# Altium project GEN3_FanCtrl_PROD_V03.PrjPcb (part 1 of 3)
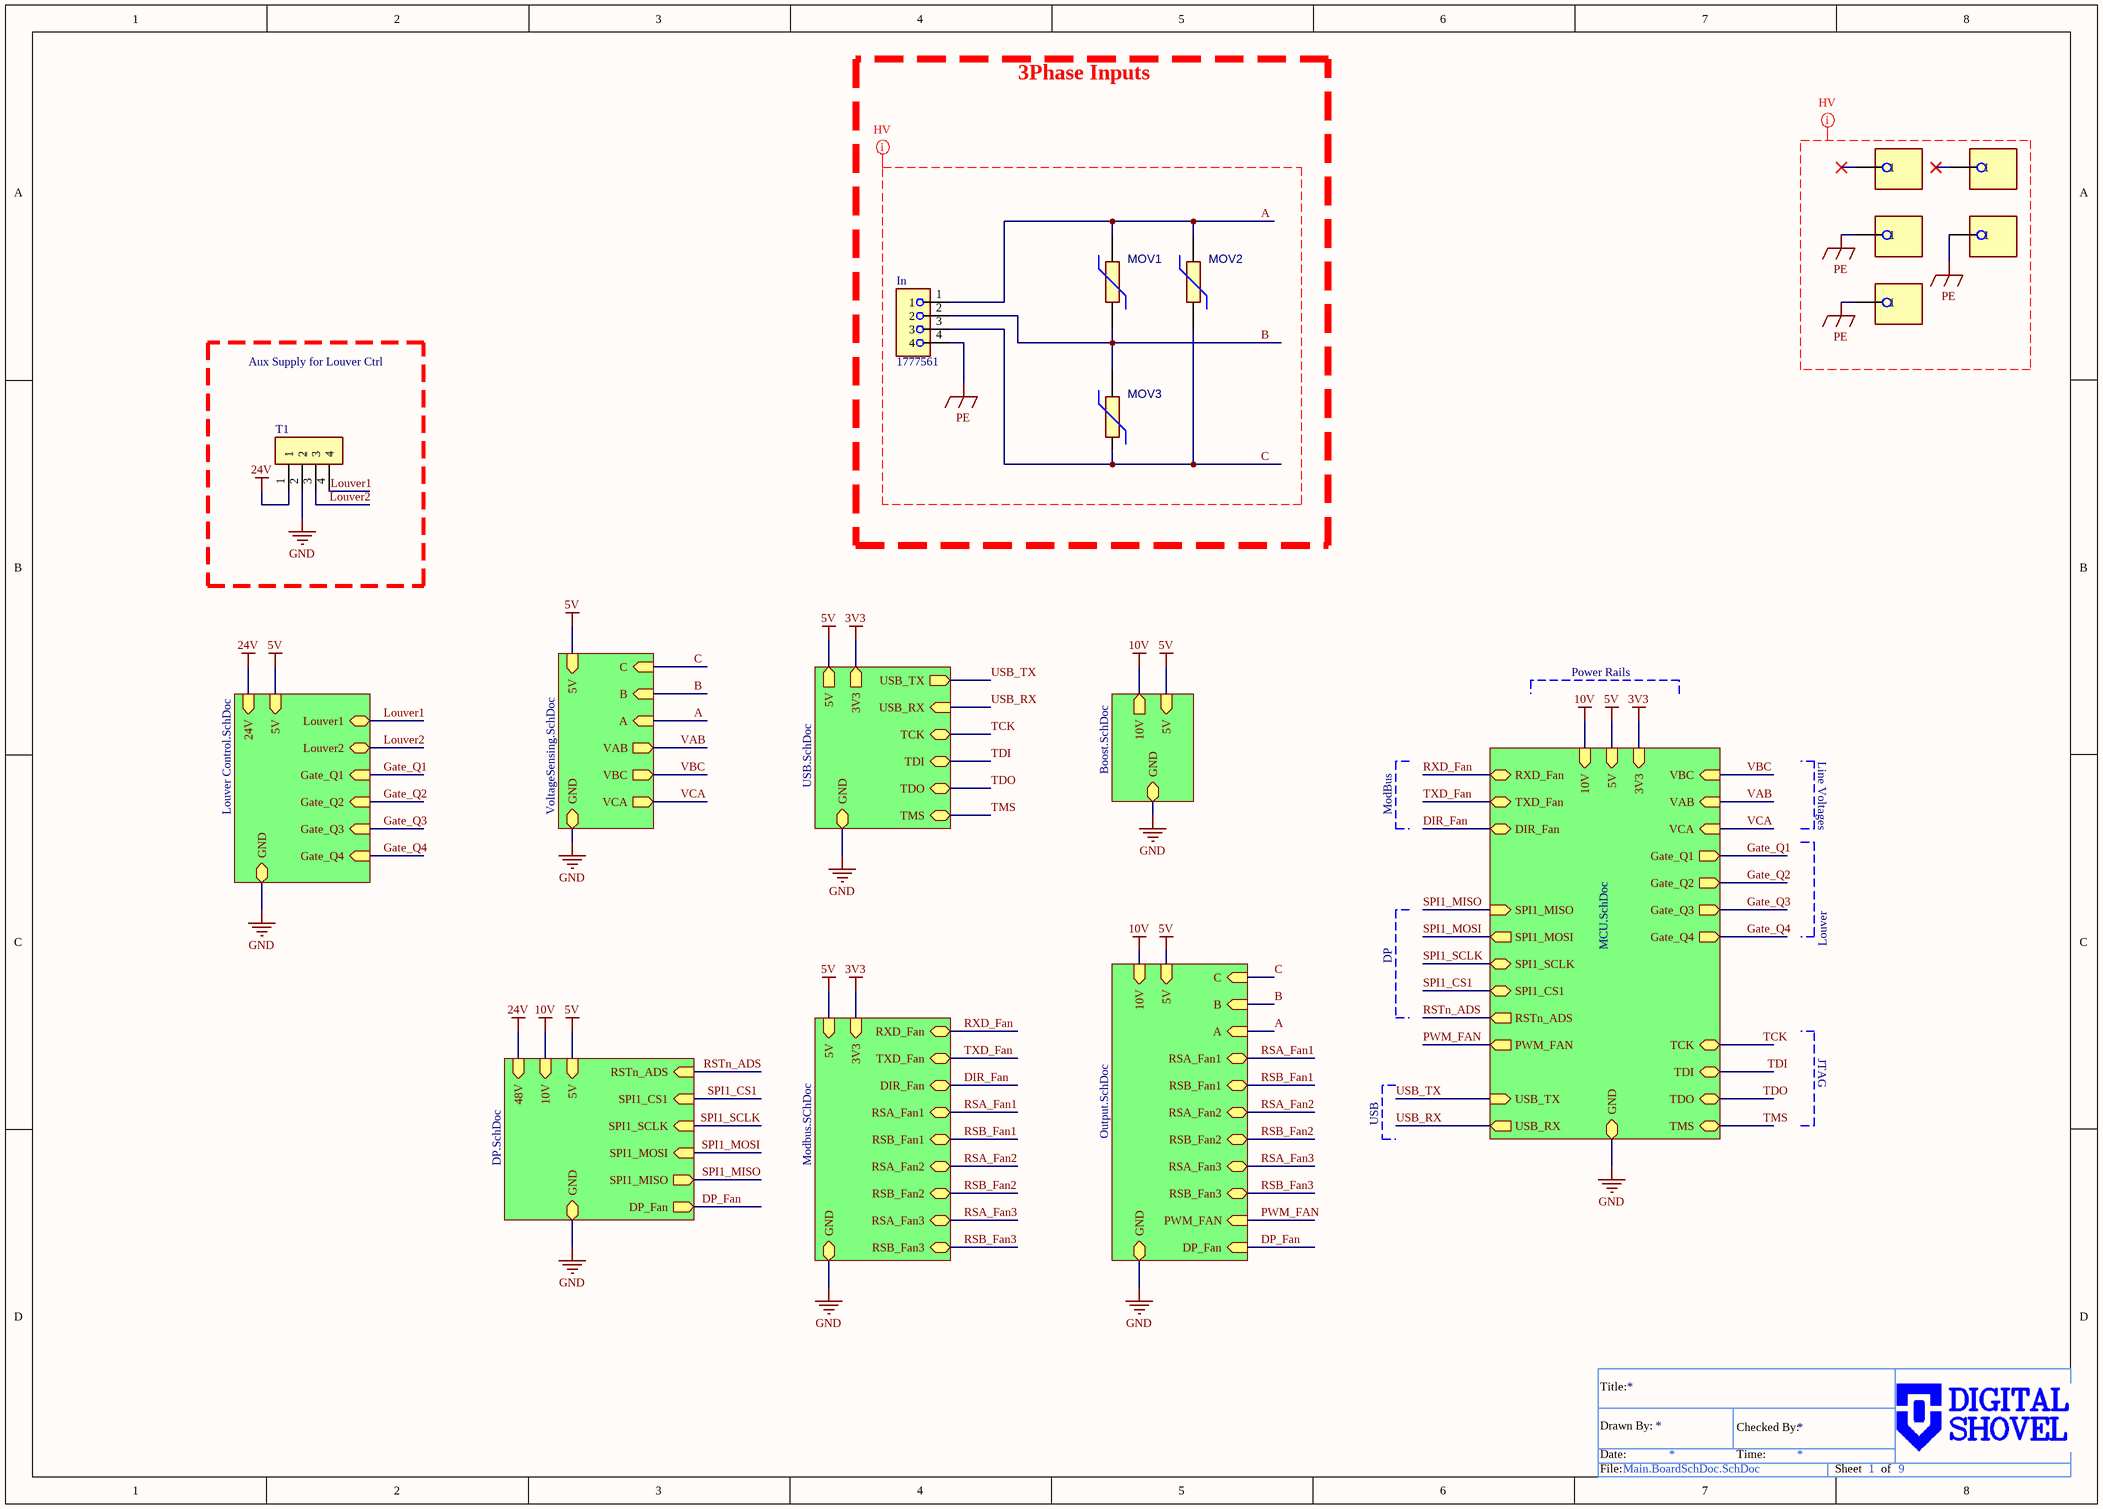
[diagram p0: Main.BoardSchDoc.SchDoc]
9 sheets, 371 parts. Net scope: hierarchical (ports join the sheet entries above them; power ports are global).
Board files: GEN3_FanCtrl_PROD_PCB_V03.PcbDoc, GEN3_FanCtrl_PROD_PCB_V03_Panel.PcbDoc
Sheets:
  Main.BoardSchDoc.SchDoc
    Designator = VoltageSensing.SchDoc
    Designator = Boost.SchDoc
    Designator = Output.SchDoc
    Designator = MCU.SchDoc
    Designator = USB.SchDoc
    Designator = ModBus.SchDoc
    Designator = DP.SchDoc
    Designator = Louver Control.SchDoc

## Sheet Main.BoardSchDoc.SchDoc
size A3; SheetNumber: 1; SheetTotal: 9; SPICEModelCachePYKVLZSU: <root> / <DocumentId>PYKVLZSU</DocumentId> / </root>

### Parts
1  Mounting Hole  [Mounting Hole]  (value not drawn)
3  Mounting Hole  [Mounting Hole]  (value not drawn)
4  Mounting Hole  [Mounting Hole]  (value not drawn)
5  Mounting Hole  [Mounting Hole]  (value not drawn)
6  Mounting Hole  [Mounting Hole]  (value not drawn)
In  1777561  [1777561-Footprint-1]
MOV1  MOV-14D102K  [MOV-14D102K-Footprint-1]  (value not drawn)
MOV2  MOV-14D102K  [MOV-14D102K-Footprint-1]  (value not drawn)
MOV3  MOV-14D102K  [MOV-14D102K-Footprint-1]  (value not drawn)
T1  1984633  [1984633-Footprint-1]  (value not drawn)

### Blocks framed on the sheet
3Phase Inputs: In MOV1-MOV3
Aux Supply for Louver Ctrl: T1

### Sub-sheets
Designator = VoltageSensing.SchDoc: GND (bidir), 5V (in), A (in), B (in), C (in), VAB (out), VBC (out), VCA (out)
Designator = Boost.SchDoc: GND (bidir), 5V (in), 10V (out)
Designator = Output.SchDoc: GND (bidir), 10V (in), A (in), B (in), C (in), 5V (in), RSA_Fan1 (bidir), RSB_Fan1 (bidir), RSA_Fan2 (bidir), RSB_Fan2 (bidir), RSA_Fan3 (bidir), RSB_Fan3 (bidir), PWM_FAN (in), DP_Fan (in)
Designator = MCU.SchDoc: VAB (in), VBC (in), VCA (in), GND (bidir), SPI1_MISO (in), SPI1_MOSI (out), SPI1_SCLK (bidir), SPI1_CS1 (bidir), 5V (in), PWM_FAN (out), RSTn_ADS (out), USB_TX (in), USB_RX (out), 3V3 (in), TCK (bidir), TDI (bidir), TDO (bidir), TMS (bidir), RXD_Fan (bidir), TXD_Fan (bidir), 10V (in), DIR_Fan (bidir), Gate_Q1 (out), Gate_Q2 (out), Gate_Q3 (out), Gate_Q4 (out)
Designator = USB.SchDoc: GND (bidir), TDI (bidir), USB_TX (out), USB_RX (in), TCK (bidir), 5V (out), TDO (bidir), 3V3 (out), TMS (bidir)
Designator = Modbus.SChDoc: GND (bidir), RXD_Fan (bidir), TXD_Fan (bidir), 5V (in), 3V3 (in), RSA_Fan1 (bidir), RSB_Fan1 (bidir), RSA_Fan2 (bidir), RSB_Fan2 (bidir), RSA_Fan3 (bidir), RSB_Fan3 (bidir), DIR_Fan (bidir)
Designator = DP.SchDoc: GND (bidir), SPI1_CS1 (in), SPI1_MISO (out), SPI1_MOSI (in), SPI1_SCLK (in), 5V (in), RSTn_ADS (in), DP_Fan (out), 10V (in), 48V (in)
Designator = Louver Control.SchDoc: GND (bidir), 24V (in), Louver1 (bidir), Louver2 (bidir), 5V (in), Gate_Q1 (in), Gate_Q2 (in), Gate_Q3 (in), Gate_Q4 (in)

### Nets
3V3: sheet Designator/3V3, sheet Designator/3V3, sheet Designator/3V3
5V: sheet Designator/5V, sheet Designator/5V, sheet Designator/5V, sheet Designator/5V, sheet Designator/5V, sheet Designator/5V, sheet Designator/5V, sheet Designator/5V
10V: sheet Designator/10V, sheet Designator/10V, sheet Designator/10V, sheet Designator/10V
24V: T1.1 ; sheet Designator/48V, sheet Designator/24V
GND: T1.2 ; sheet Designator/GND, sheet Designator/GND, sheet Designator/GND, sheet Designator/GND, sheet Designator/GND, sheet Designator/GND, sheet Designator/GND, sheet Designator/GND
PE: 1.1 5.1 6.1 In.4
A: In.1 MOV1.2 MOV2.2 ; sheet Designator/A, sheet Designator/A
B: In.2 MOV1.1 MOV3.2 ; sheet Designator/B, sheet Designator/B
C: In.3 MOV2.1 MOV3.1 ; sheet Designator/C, sheet Designator/C
DIR_Fan: sheet Designator/DIR_Fan, sheet Designator/DIR_Fan
DP_Fan: sheet Designator/DP_Fan, sheet Designator/DP_Fan
Gate_Q1: sheet Designator/Gate_Q1, sheet Designator/Gate_Q1
Gate_Q2: sheet Designator/Gate_Q2, sheet Designator/Gate_Q2
Gate_Q3: sheet Designator/Gate_Q3, sheet Designator/Gate_Q3
Gate_Q4: sheet Designator/Gate_Q4, sheet Designator/Gate_Q4
Louver1: T1.4 ; sheet Designator/Louver1
Louver2: T1.3 ; sheet Designator/Louver2
PWM_FAN: sheet Designator/PWM_FAN, sheet Designator/PWM_FAN
RSA_Fan1: sheet Designator/RSA_Fan1, sheet Designator/RSA_Fan2, sheet Designator/RSA_Fan3, sheet Designator/RSA_Fan1, sheet Designator/RSA_Fan2, sheet Designator/RSA_Fan3  [also labelled RSA_Fan2, RSA_Fan3]
RSB_Fan1: sheet Designator/RSB_Fan1, sheet Designator/RSB_Fan2, sheet Designator/RSB_Fan3, sheet Designator/RSB_Fan1, sheet Designator/RSB_Fan2, sheet Designator/RSB_Fan3  [also labelled RSB_Fan2, RSB_Fan3]
RSTn_ADS: sheet Designator/RSTn_ADS, sheet Designator/RSTn_ADS  [project net INT17a]
RXD_Fan: sheet Designator/RXD_Fan, sheet Designator/RXD_Fan
SPI1_CS1: sheet Designator/SPI1_CS1, sheet Designator/SPI1_CS1  [project net ~{C}S]
SPI1_MISO: sheet Designator/SPI1_MISO, sheet Designator/SPI1_MISO  [project net MISO]
SPI1_MOSI: sheet Designator/SPI1_MOSI, sheet Designator/SPI1_MOSI  [project net MOSI]
SPI1_SCLK: sheet Designator/SPI1_SCLK, sheet Designator/SPI1_SCLK  [project net SCLK]
TCK: sheet Designator/TCK, sheet Designator/TCK
TDI: sheet Designator/TDI, sheet Designator/TDI
TDO: sheet Designator/TDO, sheet Designator/TDO
TMS: sheet Designator/TMS, sheet Designator/TMS
TXD_Fan: sheet Designator/TXD_Fan, sheet Designator/TXD_Fan
USB_RX: sheet Designator/USB_RX, sheet Designator/USB_RX
USB_TX: sheet Designator/USB_TX, sheet Designator/USB_TX
VAB: sheet Designator/VAB, sheet Designator/VAB  [project net AINA07]
VBC: sheet Designator/VBC, sheet Designator/VBC  [project net AINA06]
VCA: sheet Designator/VCA, sheet Designator/VCA  [project net AINA05]

Not connected (* = marked no-connect by the designer): 3 1*; 4 1*

### Layout directives
net class HV: A, B, C, PE

### Notes on the sheet
- Power Rails
- Line Voltages
- ModBus
- Louver
- DP
- JTAG
- USB
- Title:
- Date:
- Drawn By:
- Time:
- Checked By:
- File:
- Sheet
- of

### Library data of the parts
1 3-6 = CMP-002-00649-4: Aluminum 1/4 Hex Female Standoff, 4MM
In = CMP-002-01216-2: 4 Position Wire to Board Terminal Block Horizontal with Board 0.250" (6.35mm) Through Hole; Voltage Rating: 1kV; Max Current Rating: 30A; Mounting Technology: Board; RoHS Compliant: Yes
MOV1-MOV3 = CMP-009-01038-1: Varistor, 825V, 190J, Through Hole Mount; Power: 600mW; Pins: 2; Max Operating Temperature: 85°C; RoHS Compliant: Yes; Min Operating Temperature: -40°C; Mounting Technology: Through Hole
T1 = CMP-002-01217-1: Barrier Strip Terminal Block, 17.5A, 1.5mm2, 1 Row(s), 1 Deck(s); Voltage Rating: 200V; RoHS Compliant: Yes; Mounting Technology: Board

## Sheet VoltageSensing.SchDoc
size A4; SPICEModelCacheCLRMJWCR: <root> / <DocumentId>CLRMJWCR</DocumentId> / <CacheFrame Number="0"> / <Model Name="tmk107b7105_a-t" Kind="CKT"> / <Text>* TMK107B7105_A-T     SPICE MODEL  ( General Type ) / *-------------------------------------------------------------------------------------------------------- / * Model Generated by TAIYO YUDEN Corporation (http://www.ty-top.com) / * Version 1.0 / * TAIYO YUDEN Control No. 170508_100817 / * Copyright(c) 2012 TAIYO YUDEN CO.,LTD. All Rights Reserved. / *-------------------------------------------------------------------------------------------------------- / * / * Products Name : Multilayer Ceramic Capacitors / * / * Characteristics : / *     Capacitance : 1 uF , Rated Voltage : 25V , TCC : X7R / *     Case Size : 1.6 x 0.8 / 0.063 x 0.031 [mm/inch] , Thickness : 0.8 / 0.031 [mm/inch] / *     (Conditions: Temperature = 25 degC , DC Bias Current/Voltage = 0A / 0V) / * / * Frequency Range : 40Hz - 3GHz / * / * External Node Assignments : / * / *  1  o---| |---o  2 / * / *-------------------------------------------------------------------------------------------------------- / .SubCkt TMK107B7105_A-T 1 2 / **************************** / C0 1 110 0.8077u / Cm 1 101 0.091409u / C1 101 102 0.22841u / Rc1 101 102 2.6849k / C2 102 103 0.056864u / Rc2 102 103 354.66 / C3 103 110 0.05273u / Rc3 103 110 25.631 / C2m 1 301 0.15309u / C21 301 302 0.37938u / Rc21 301 302 9.5172k / C22 302 303 0.45808u / Rc22 302 303 6.9429k / C23 303 304 0.40786u / Rc23 303 304 2.3301k / C24 304 305 0.15311u / Rc24 304 305 806.02 / C25 305 306 0.22413u / Rc25 305 306 462.56 / C26 306 307 0.18632u / Rc26 306 307 35.279 / C27 307 308 0.15722u / Rc27 307 308 39.531 / C28 308 309 0.078196u / Rc28 308 309 48.947 / C29 309 110 6560.8p / Rc29 309 110 9.5708 / Rp0 1 110 100Meg / L0 110 120 0.29644n / Lm 120 130 0.15558n / L1 120 121 0.202n / RL1 121 130 0.16398 / L2 120 122 0.33479n / RL2 122 130 0.31977 / L3 120 123 0.92343n / RL3 123 130 0.85069 / CR 120 124 0.21801u / LR 124 125 0.13885n / RR 125 130 35.905m / CL 130 140 1.934p / LL 130 140 0.19618n / RL 130 140 45.012 / Rs 140 2 6.428m / **************************** / .ends TMK107B7105_A-T</Text> / </Model> / </CacheFrame> / </root>; SheetNumber: 5; SheetTotal: 9
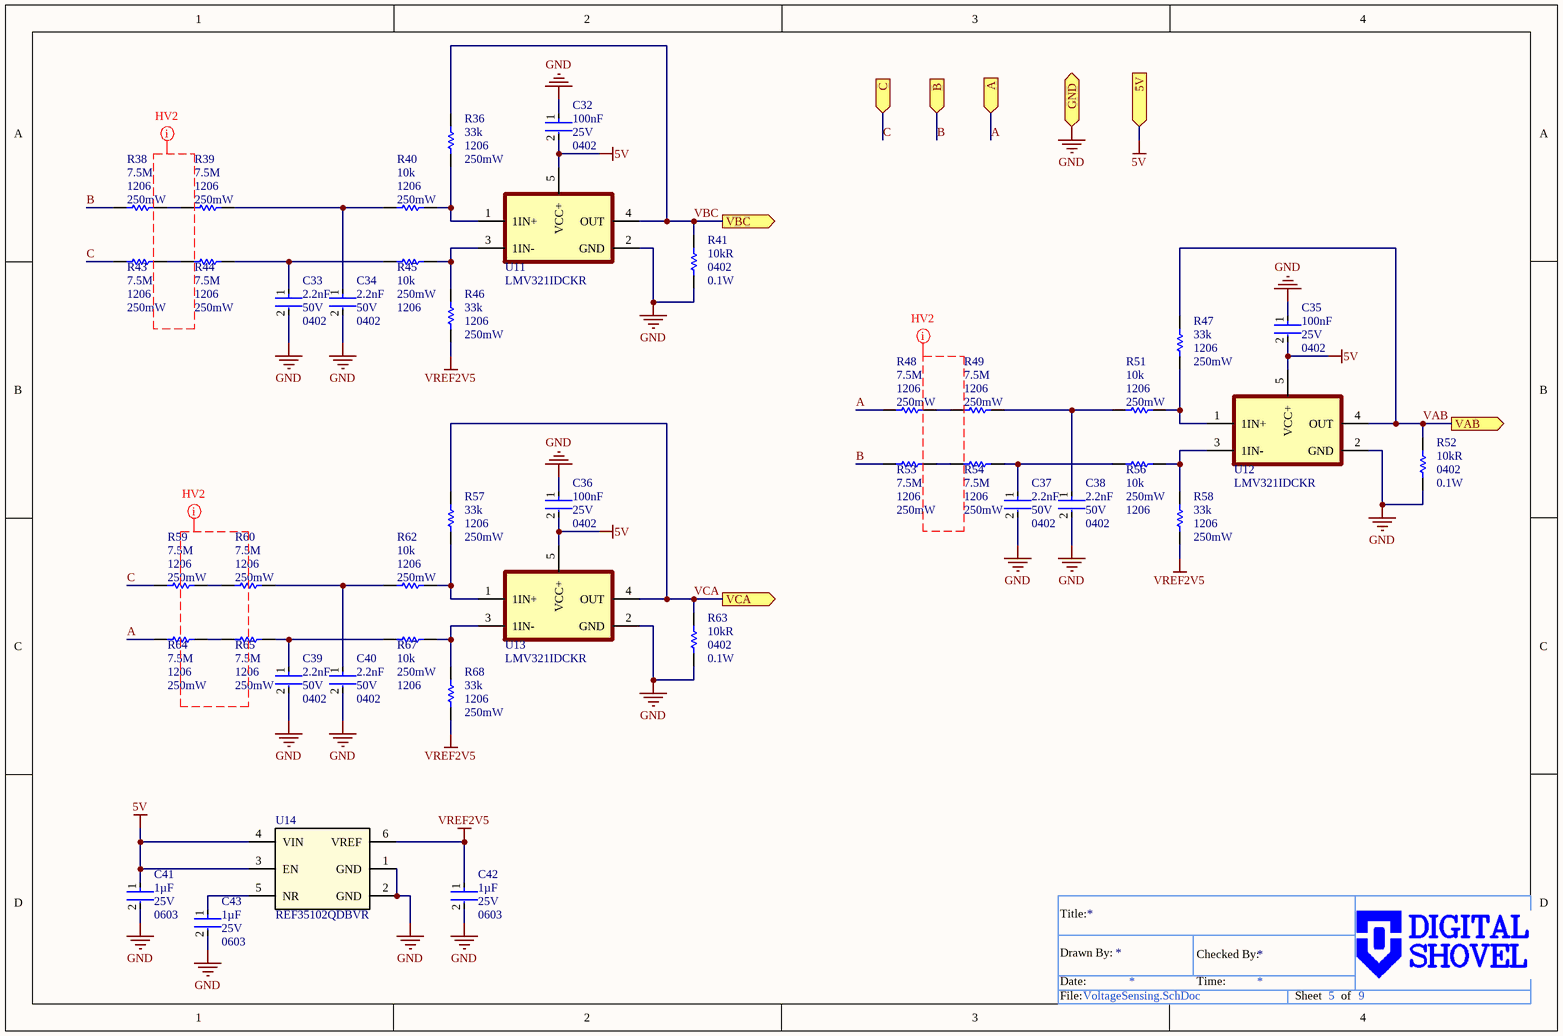
[diagram p1: VoltageSensing.SchDoc]

### Parts
C32  value 100nF  Voltage Rating: 25V  Case/Package: 0402  [FP-CL830-IPC_A]  (hidden comment: CL05B104KA5NNNC)
C33  value 2.2nF  Voltage Rating: 50V  Case/Package: 0402  [FP-C0402-BB-IPC_A]  (hidden comment: C0402C222J5RACTU)
C34  value 2.2nF  Voltage Rating: 50V  Case/Package: 0402  [FP-C0402-BB-IPC_A]  (hidden comment: C0402C222J5RACTU)
C35  value 100nF  Voltage Rating: 25V  Case/Package: 0402  [FP-CL830-IPC_A]  (hidden comment: CL05B104KA5NNNC)
C36  value 100nF  Voltage Rating: 25V  Case/Package: 0402  [FP-CL830-IPC_A]  (hidden comment: CL05B104KA5NNNC)
C37  value 2.2nF  Voltage Rating: 50V  Case/Package: 0402  [FP-C0402-BB-IPC_A]  (hidden comment: C0402C222J5RACTU)
C38  value 2.2nF  Voltage Rating: 50V  Case/Package: 0402  [FP-C0402-BB-IPC_A]  (hidden comment: C0402C222J5RACTU)
C39  value 2.2nF  Voltage Rating: 50V  Case/Package: 0402  [FP-C0402-BB-IPC_A]  (hidden comment: C0402C222J5RACTU)
C40  value 2.2nF  Voltage Rating: 50V  Case/Package: 0402  [FP-C0402-BB-IPC_A]  (hidden comment: C0402C222J5RACTU)
C41  value 1µF  Voltage Rating: 25V  Case/Package: 0603  [FP-0603-L_1_6_0_1-W_0_8_0-IPC_A]  (hidden comment: TMK107B7105KA-T)
C42  value 1µF  Voltage Rating: 25V  Case/Package: 0603  [FP-0603-L_1_6_0_1-W_0_8_0-IPC_A]  (hidden comment: TMK107B7105KA-T)
C43  value 1µF  Voltage Rating: 25V  Case/Package: 0603  [FP-0603-L_1_6_0_1-W_0_8_0-IPC_A]  (hidden comment: TMK107B7105KA-T)
R36  value 33k  Power: 250mW  Case/Package: 1206  [RESC3216X70X40NL20T20]  (hidden comment: RK73H2BTTD3302F)
R38  value 7.5M  Case/Package: 1206  Power: 250mW  [FP-KTR18-IPC_A]  (hidden comment: KTR18EZPF7504)
R39  value 7.5M  Case/Package: 1206  Power: 250mW  [FP-KTR18-IPC_A]  (hidden comment: KTR18EZPF7504)
R40  value 10k  Power: 250mW  Case/Package: 1206  [RESC3216X70X40NL20T20]  (hidden comment: RK73H2BTTD1002F)
R41  value 10kR  Package: 0402  Power: 0.1W  [RESC1005X40X25LL10T10]  (hidden comment: RK73H1ETTP1002F)
R43  value 7.5M  Case/Package: 1206  Power: 250mW  [FP-KTR18-IPC_A]  (hidden comment: KTR18EZPF7504)
R44  value 7.5M  Case/Package: 1206  Power: 250mW  [FP-KTR18-IPC_A]  (hidden comment: KTR18EZPF7504)
R45  value 10k  Power: 250mW  Case/Package: 1206  [RESC3216X70X40NL20T20]  (hidden comment: RK73H2BTTD1002F)
R46  value 33k  Power: 250mW  Case/Package: 1206  [RESC3216X70X40NL20T20]  (hidden comment: RK73H2BTTD3302F)
R47  value 33k  Power: 250mW  Case/Package: 1206  [RESC3216X70X40NL20T20]  (hidden comment: RK73H2BTTD3302F)
R48  value 7.5M  Case/Package: 1206  Power: 250mW  [FP-KTR18-IPC_A]  (hidden comment: KTR18EZPF7504)
R49  value 7.5M  Case/Package: 1206  Power: 250mW  [FP-KTR18-IPC_A]  (hidden comment: KTR18EZPF7504)
R51  value 10k  Power: 250mW  Case/Package: 1206  [RESC3216X70X40NL20T20]  (hidden comment: RK73H2BTTD1002F)
R52  value 10kR  Package: 0402  Power: 0.1W  [RESC1005X40X25LL10T10]  (hidden comment: RK73H1ETTP1002F)
R53  value 7.5M  Case/Package: 1206  Power: 250mW  [FP-KTR18-IPC_A]  (hidden comment: KTR18EZPF7504)
R54  value 7.5M  Case/Package: 1206  Power: 250mW  [FP-KTR18-IPC_A]  (hidden comment: KTR18EZPF7504)
R56  value 10k  Power: 250mW  Case/Package: 1206  [RESC3216X70X40NL20T20]  (hidden comment: RK73H2BTTD1002F)
R57  value 33k  Power: 250mW  Case/Package: 1206  [RESC3216X70X40NL20T20]  (hidden comment: RK73H2BTTD3302F)
R58  value 33k  Power: 250mW  Case/Package: 1206  [RESC3216X70X40NL20T20]  (hidden comment: RK73H2BTTD3302F)
R59  value 7.5M  Case/Package: 1206  Power: 250mW  [FP-KTR18-IPC_A]  (hidden comment: KTR18EZPF7504)
R60  value 7.5M  Case/Package: 1206  Power: 250mW  [FP-KTR18-IPC_A]  (hidden comment: KTR18EZPF7504)
R62  value 10k  Power: 250mW  Case/Package: 1206  [RESC3216X70X40NL20T20]  (hidden comment: RK73H2BTTD1002F)
R63  value 10kR  Package: 0402  Power: 0.1W  [RESC1005X40X25LL10T10]  (hidden comment: RK73H1ETTP1002F)
R64  value 7.5M  Case/Package: 1206  Power: 250mW  [FP-KTR18-IPC_A]  (hidden comment: KTR18EZPF7504)
R65  value 7.5M  Case/Package: 1206  Power: 250mW  [FP-KTR18-IPC_A]  (hidden comment: KTR18EZPF7504)
R67  value 10k  Power: 250mW  Case/Package: 1206  [RESC3216X70X40NL20T20]  (hidden comment: RK73H2BTTD1002F)
R68  value 33k  Power: 250mW  Case/Package: 1206  [RESC3216X70X40NL20T20]  (hidden comment: RK73H2BTTD3302F)
U11  LMV321IDCKR  [LMV321IDCKR-Footprint-1]
U12  LMV321IDCKR  [LMV321IDCKR-Footprint-1]
U13  LMV321IDCKR  [LMV321IDCKR-Footprint-1]
U14  REF35102QDBVR  [REF35102QDBVR-Footprint-1]

### Ports
5V (in), A (in), B (in), C (in), GND (bidir), VAB (out), VBC (out), VCA (out)

### Nets
5V: C32.2 C35.2 C36.2 C41.1 U11.5(VCC+) U12.5(VCC+) U13.5(VCC+) U14.3(EN) U14.4(VIN) ; port 5V
GND: C32.1 C33.2 C34.2 C35.1 C36.1 C37.2 C38.2 C39.2 C40.2 C41.2 C42.2 C43.2 R41.2 R52.2 R63.2 U11.2(GND) U12.2(GND) U13.2(GND) U14.1(GND) U14.2(GND) ; port GND
VREF2V5: C42.1 R46.1 R58.1 R68.1 U14.6(VREF)
A: R48.2 R64.2 ; port A
B: R38.2 R53.2 ; port B
C: R43.2 R59.2 ; port C
VAB: R47.2 R52.1 U12.4(OUT) ; port VAB  [project net AINA07]
VBC: R36.2 R41.1 U11.4(OUT) ; port VBC  [project net AINA06]
VCA: R57.2 R63.1 U13.4(OUT) ; port VCA  [project net AINA05]
NetC33_1: C33.1 R44.1 R45.1
NetC34_1: C34.1 R39.1 R40.1
NetC37_1: C37.1 R54.1 R56.1
NetC38_1: C38.1 R49.1 R51.1
NetC39_1: C39.1 R65.1 R67.1
NetC40_1: C40.1 R60.1 R62.1
NetC43_1: C43.1 U14.5(NR)
NetR36_1: R36.1 R40.2 U11.1(1IN+)
NetR38_1: R38.1 R39.2
NetR43_1: R43.1 R44.2
NetR45_2: R45.2 R46.2 U11.3(1IN-)
NetR47_1: R47.1 R51.2 U12.1(1IN+)
NetR48_1: R48.1 R49.2
NetR53_1: R53.1 R54.2
NetR56_2: R56.2 R58.2 U12.3(1IN-)
NetR57_1: R57.1 R62.2 U13.1(1IN+)
NetR59_1: R59.1 R60.2
NetR64_1: R64.1 R65.2
NetR67_2: R67.2 R68.2 U13.3(1IN-)

### Layout directives
net class HV2: (no net found under the mark)

### Notes on the sheet
- Title:
- Date:
- Drawn By:
- Time:
- Checked By:
- File:
- Sheet
- of

### Library data of the parts
C32 C35 C36 = CMP-001-00333-1: Ceramic Capacitor, Multilayer, Ceramic, 25V, 10% +Tol, 10% -Tol, X7R, 15% TC, 0.1uF, Surface Mount, 0402; Max Operating Temperature: 125°C; RoHS Compliant: Yes; Capacitor Type: Ceramic; Min Operating Temperature: -55°C; Pins: 2; Mounting Technology: Surface Mount
C33 C34 C37-C40 = CMP-001-00335-1: Ceramic Capacitor, Multilayer, Ceramic, 50V, 5% +Tol, 5% -Tol, X7R, 15% TC, 0.0022uF, Surface Mount, 0402; Pins: 2; RoHS Compliant: Yes; Mounting Technology: Surface Mount; Max Operating Temperature: 125°C; Capacitor Type: Ceramic; Min Operating Temperature: -55°C
C41-C43 = CMP-001-00326-1: Ceramic Capacitor, Multilayer, Ceramic, 25V, 10% +Tol, 10% -Tol, X7R, 15% TC, 1uF, Surface Mount, 0603; Pins: 2; Capacitor Type: Ceramic; Min Operating Temperature: -55°C; Max Operating Temperature: 125°C; RoHS Compliant: Yes; Mounting Technology: Surface Mount
R36 R46 R47 R57 R58 R68 = CMP-009-01018-1: Fixed Resistor, Metal Glaze/thick Film, 0.25W, 33000ohm, 200V, 1% +/-Tol, 100ppm/Cel, Surface Mount, 1206; Pins: 2; Max Operating Temperature: 155°C; Tolerance: 1%; Min Operating Temperature: -55°C; Mounting Technology: Surface Mount; RoHS Compliant: Yes
R38 R39 R43 R44 R48 R49 R53 R54 R59 R60 R64 R65 = CMP-009-01037-1: Fixed Resistor, 0.25W, 7500000ohm, 500V, 1% +/-Tol, 100ppm/Cel, Surface Mount, 1206; Voltage Rating: 500V; Min Operating Temperature: -55°C; Max Operating Temperature: 155°C; RoHS Compliant: Yes; Pins: 2; Mounting Technology: Surface Mount; Tolerance: 1%
R40 R45 R51 R56 R62 R67 = CMP-009-00976-1: Fixed Resistor, Metal Glaze/thick Film, 0.25W, 10000ohm, 200V, 1% +/-Tol, 100ppm/Cel, Surface Mount, 1206; RoHS Compliant: Yes; Pins: 2; Mounting Technology: Surface Mount; Tolerance: 1%; Max Operating Temperature: 155°C; Min Operating Temperature: -55°C
R41 R52 R63 = CMP-x00150-2: Fixed Resistor, Metal Glaze/thick Film, 0.1W, 10000ohm, 75V, 1% +/-Tol, 100ppm/Cel, Surface Mount, 0402; Template: KS_0402_R
U11-U13 = CMP-014-00033-1: Operational Amplifier, 1 Func, 7000uV Offset-Max, BIPolar, PDSO5; Channels: 1; Nominal Supply Voltage: 2.7V; Pins: 5; RoHS Compliant: Yes; Min Operating Temperature: -40°C; Case/Package: TSSOP; Max Operating Temperature: 125°C
U14 = CMP-031-00033-1: 650-nA quiescent current, 12-ppm/°C drift, ultra-low-power precision voltage reference 6-SOT-23 -40 to 125

## Sheet Boost.SchDoc
size A4; SheetNumber: 7; SheetTotal: 8
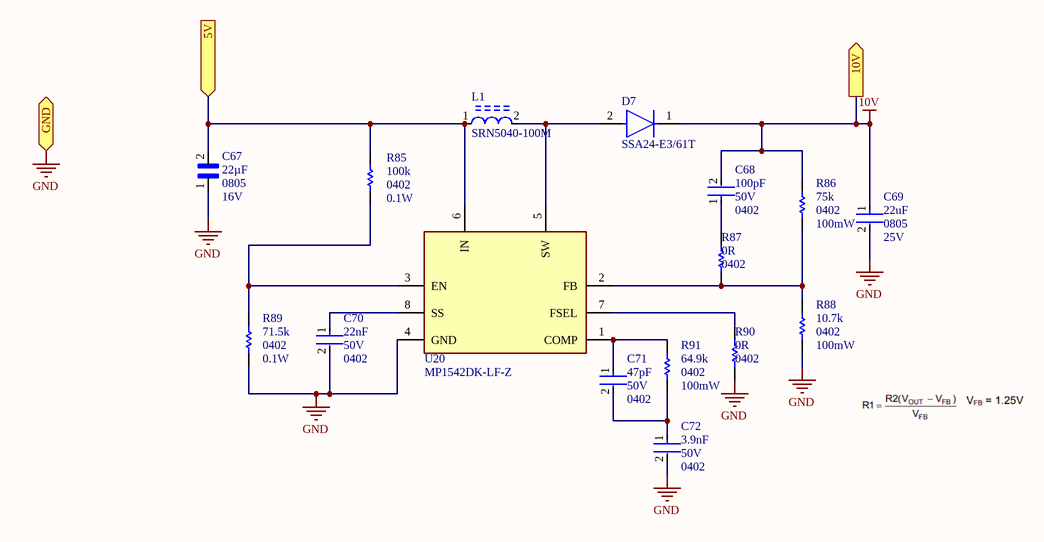
[diagram p2: Boost.SchDoc]

### Parts
C67  value 22µF  Case/Package: 0805  Voltage Rating: 16V  [CAPC0805(2012)145_L]  (hidden comment: CL21A226MOQNNNE)
C68  value 100pF  Package: 0402  Rating: 50V  [FP-CC0402-MFG]  (hidden comment: CC0402KRX7R9BB101)
C69  value 22uF  Package: 0805  Voltage Rating: 25V  [FP-GRM21B-0_2-e0_2_0_7-MFG]  (hidden comment: GRM21BR61E226ME44L)
C70  value 22nF  Case/Package: 0402  Voltage Rating: 50V  [FP-GCM155-0_05-IPC_A]  (hidden comment: GCM155R71H223KA55D)
C71  value 47pF  Package: 0402  Rating: 50V  [FP-C0402-BB-MFG]  (hidden comment: C0402C470J5GACTU)
C72  value 3.9nF  Case/Package: 0402  Voltage Rating: 50V  [FP-CC0402-IPC_A]  (hidden comment: CC0402KRX7R9BB392)
D7  SSA24-E3/61T  [FP-95400-MFG]
L1  SRN5040-100M  [FP-SRN5040-MFG]
R85  value 100k  Package: 0402  MOQ: 0.1W  [RESC1005X40X25LL10T10]  (hidden comment: RK73H1ETTP1003F)
R86  value 75k  Case/Package: 0402  Power: 100mW  [RESC1005X40X25LL10T10]  (hidden comment: RK73H1ETTP7502F)
R87  value 0R  Package: 0402  [FP-RK73Z1E-IPC_B]  (hidden comment: RK73Z1ETTP)
R88  value 10.7k  Power: 100mW  Case/Package: 0402  [RESC1005X40X25LL10T10]  (hidden comment: RK73H1ETTP1072F)
R89  value 71.5k  Mounting: 0402  Package: 0.1W  [RESC1005X40X25LL10T10]  (hidden comment: RK73H1ETTP7152F)
R90  value 0R  Package: 0402  [FP-RK73Z1E-IPC_B]  (hidden comment: RK73Z1ETTP)
R91  value 64.9k  Case/Package: 0402  Power: 100mW  [RESC1005X40X25LL10T10]  (hidden comment: RK73H1ETTP6492F)
U20  MP1542DK-LF-Z  [MP1542-Footprint-1]

### Ports
5V (in), 10V (out), GND (bidir)

### Nets
5V: C67.2 L1.1 R85.2 U20.6(IN) ; port 5V
10V: C68.2 C69.1 D7.1(C) R86.2 ; port 10V
GND: C67.1 C69.2 C70.2 C72.2 R88.1 R89.1 R90.1 U20.4(GND) ; port GND
NetC68_1: C68.1 R87.2
NetC70_1: C70.1 U20.8(SS)
NetC71_1: C71.1 R91.2 U20.1(COMP)
NetC71_2: C71.2 C72.1 R91.1
NetD7_2: D7.2(A) L1.2 U20.5(SW)
NetR85_1: R85.1 R89.2 U20.3(EN)
NetR86_1: R86.1 R87.1 R88.2 U20.2(FB)
NetR90_2: R90.2 U20.7(FSEL)

### Notes on the sheet
- Title:
- Date:
- Drawn By:
- Time:
- Checked By:
- File:
- Sheet
- of

### Library data of the parts
C67 = CMP-001-00081-17: Chip Capacitor, 22µF +/-40%, 16V, 0805, Thickness 1.45 mm; Tolerance: 5%; Max Operating Temperature: 85°C; Pins: 2; Mounting Technology: SMT; Min Operating Temperature: -55°C
C68 = CMP-x00153-2: Ceramic Capacitor, Multilayer, Ceramic, 50V, 10% +Tol, 10% -Tol, X7R, 15% TC, 0.0001uF, Surface Mount, 0402; Template: YG_0402_C
C69 = CMP-x00061-2: Ceramic Capacitor, Multilayer, Ceramic, 25V, 20% +Tol, 20% -Tol, X5R, 15% TC, 22uF, Surface Mount, 0805; Manufacturer: Murata; Vendor: TTI; Reel Width: 8mm; Template: MR_0805; Price: 0.093; MOQ: 3000; Category: Capacitor; Mounting: SMT
C70 = CMP-001-00345-1: Ceramic Capacitor, Multilayer, Ceramic, 50V, 10% +Tol, 10% -Tol, X7R, 15% TC, 0.022uF, Surface Mount, 0402; RoHS Compliant: Yes; Min Operating Temperature: -55°C; Pins: 2; Mounting Technology: Surface Mount; Max Operating Temperature: 125°C; Capacitor Type: Ceramic
C71 = CMP-x00009-2: Ceramic Capacitor, Multilayer, Ceramic, 50V, 5% +Tol, 5% -Tol, C0G, 30ppm/Cel TC, 0.000047uF, Surface Mount, 0402; Price: 0.0022; Mounting: SMT; MOQ: 10000
C72 = CMP-001-00344-1: Ceramic Capacitor, Multilayer, Ceramic, 50V, 10% +Tol, 10% -Tol, X7R, 15% TC, 0.0039uF, Surface Mount, 0402; Mounting Technology: Surface Mount; Capacitor Type: Ceramic; RoHS Compliant: Yes; Pins: 2; Min Operating Temperature: -55°C; Max Operating Temperature: 125°C
D7 = CMP-x00060-3: Rectifier Diode, Schottky, 1 Phase, 1 Element, 2A, 40V V(RRM), Silicon, DO-214AC; Manufacturer: Vishay; Template: VS_DO214; Vendor: TTI; Reel Width: 12mm; Value: 40V; Package: DO214AC; Price: 0.04; MOQ: 1800; Mounting: SMT; Category: Diode
L1 = CMP-x00063-2: General Purpose Inductor, 10uH, 20%, 1 Element, Ferrite-Core, SMD, 2020; Manufacturer: Bourns; Vendor: TTI; Reel Width: 12mm; Template: BR_5040; MOQ: 1000; Price: 0.18; Value: 10uH; Mounting: SMT; Category: Inductor; Package: 5040
R85 = CMP-x00162-2: Fixed Resistor, Metal Glaze/thick Film, 0.1W, 100000ohm, 75V, 1% +/-Tol, 100ppm/Cel, Surface Mount, 0402; Manufacturer: KOA Speer; Template: KS_0402_R; Mounting: SMD; Category: Resistors
R86 = CMP-009-01025-1: Fixed Resistor, Metal Glaze/thick Film, 0.1W, 75000ohm, 75V, 1% +/-Tol, 100ppm/Cel, Surface Mount, 0402; Max Operating Temperature: 155°C; RoHS Compliant: Yes; Tolerance: 1%; Pins: 2; Min Operating Temperature: -55°C; Mounting Technology: Surface Mount
R87 R90 = CMP-x00147-2: Metal Glaze/thick Film, 0ohm, Surface Mount, 0402; Template: KS_0402_R
R88 = CMP-009-01026-1: Fixed Resistor, Metal Glaze/thick Film, 0.1W, 10700ohm, 75V, 1% +/-Tol, 100ppm/Cel, Surface Mount, 0402; Max Operating Temperature: 155°C; RoHS Compliant: Yes; Pins: 2; Mounting Technology: Surface Mount; Tolerance: 1%; Min Operating Temperature: -55°C
R89 = CMP-x00176-1: Fixed Resistor, Metal Glaze/thick Film, 0.1W, 71500ohm, 75V, 1% +/-Tol, 100ppm/Cel, Surface Mount, 0402
R91 = CMP-009-01027-1: Fixed Resistor, Metal Glaze/thick Film, 0.1W, 64900ohm, 75V, 1% +/-Tol, 100ppm/Cel, Surface Mount, 0402; Mounting Technology: Surface Mount; Max Operating Temperature: 155°C; Pins: 2; Tolerance: 1%; Min Operating Temperature: -55°C; RoHS Compliant: Yes
U20 = CMP-x00054-4: Switching Regulator, Current-mode, 2A, 1500kHz Switching Freq-Max, PDSO8; Manufacturer: MPS; Value: 3V - 22V; Vendor: Mouser; Template: MP_MSOP_8; Reel Width: 12mm; Package: MSOP-8; Price: 1.25; MOQ: 2500; Mounting: SMT; Category: IC

## Sheet Output.SchDoc
size A2; SPICEModelCacheAEWMZWDM: <root> / <DocumentId>AEWMZWDM</DocumentId> / </root>; SheetNumber: 8; SheetTotal: 9
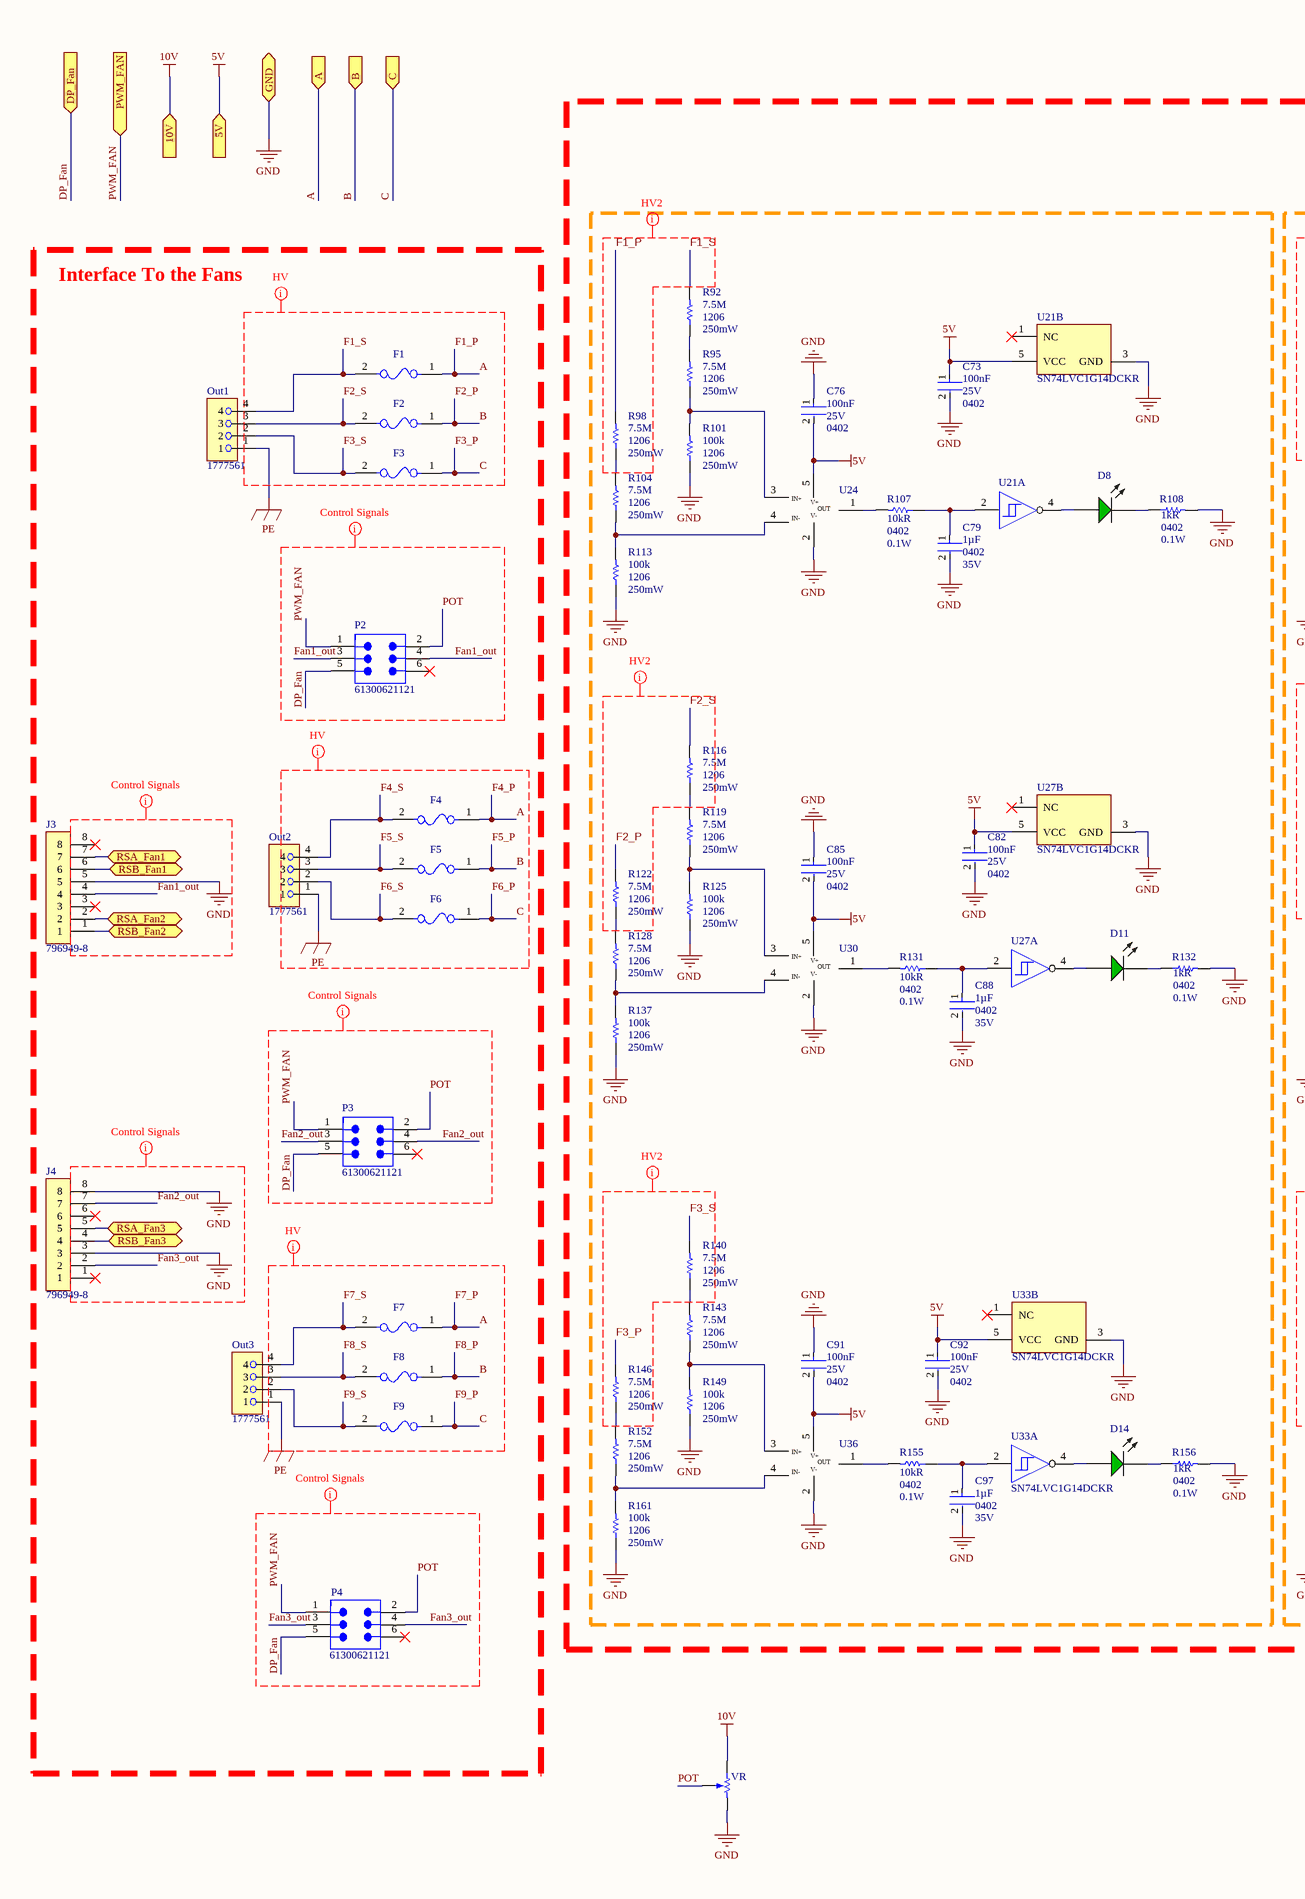
[diagram p3: Output.SchDoc, left]
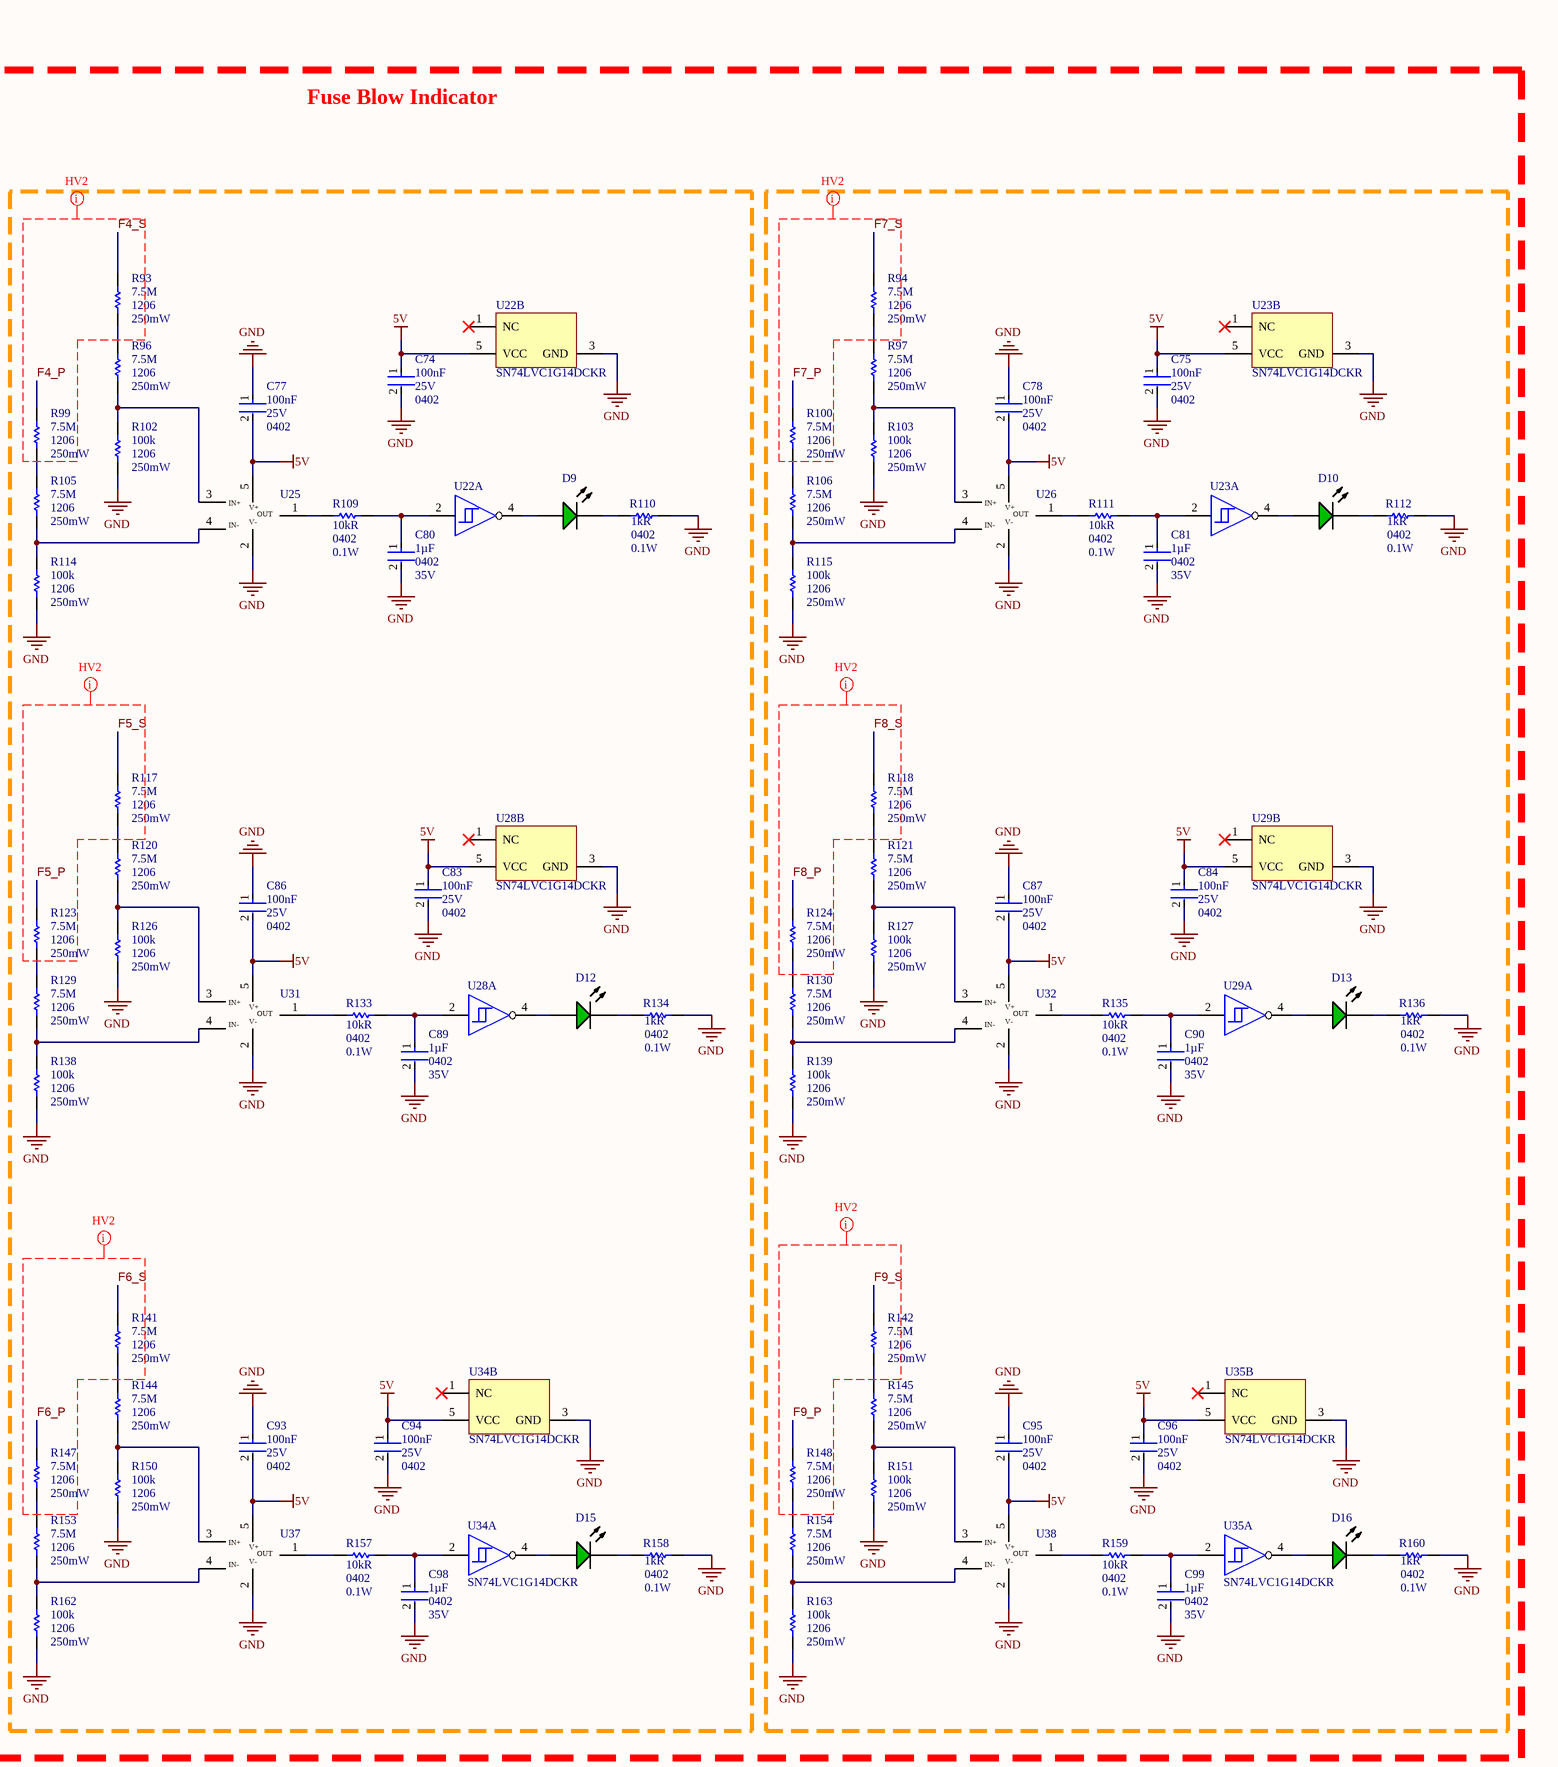
[diagram p4: Output.SchDoc, right]

### Parts
C73  value 100nF  Voltage Rating: 25V  Case/Package: 0402  [FP-CL830-IPC_A]  (hidden comment: CL05B104KA5NNNC)
C74  value 100nF  Voltage Rating: 25V  Case/Package: 0402  [FP-CL830-IPC_A]  (hidden comment: CL05B104KA5NNNC)
C75  value 100nF  Voltage Rating: 25V  Case/Package: 0402  [FP-CL830-IPC_A]  (hidden comment: CL05B104KA5NNNC)
C76  value 100nF  Voltage Rating: 25V  Case/Package: 0402  [FP-CL830-IPC_A]  (hidden comment: CL05B104KA5NNNC)
C77  value 100nF  Voltage Rating: 25V  Case/Package: 0402  [FP-CL830-IPC_A]  (hidden comment: CL05B104KA5NNNC)
C78  value 100nF  Voltage Rating: 25V  Case/Package: 0402  [FP-CL830-IPC_A]  (hidden comment: CL05B104KA5NNNC)
C79  value 1µF  Case/Package: 0402  Voltage Rating: 35V  [FP-C1005-050-0_05-IPC_A]  (hidden comment: C1005JB1V105K050BC)
C80  value 1µF  Case/Package: 0402  Voltage Rating: 35V  [FP-C1005-050-0_05-IPC_A]  (hidden comment: C1005JB1V105K050BC)
C81  value 1µF  Case/Package: 0402  Voltage Rating: 35V  [FP-C1005-050-0_05-IPC_A]  (hidden comment: C1005JB1V105K050BC)
C82  value 100nF  Voltage Rating: 25V  Case/Package: 0402  [FP-CL830-IPC_A]  (hidden comment: CL05B104KA5NNNC)
C83  value 100nF  Voltage Rating: 25V  Case/Package: 0402  [FP-CL830-IPC_A]  (hidden comment: CL05B104KA5NNNC)
C84  value 100nF  Voltage Rating: 25V  Case/Package: 0402  [FP-CL830-IPC_A]  (hidden comment: CL05B104KA5NNNC)
C85  value 100nF  Voltage Rating: 25V  Case/Package: 0402  [FP-CL830-IPC_A]  (hidden comment: CL05B104KA5NNNC)
C86  value 100nF  Voltage Rating: 25V  Case/Package: 0402  [FP-CL830-IPC_A]  (hidden comment: CL05B104KA5NNNC)
C87  value 100nF  Voltage Rating: 25V  Case/Package: 0402  [FP-CL830-IPC_A]  (hidden comment: CL05B104KA5NNNC)
C88  value 1µF  Case/Package: 0402  Voltage Rating: 35V  [FP-C1005-050-0_05-IPC_A]  (hidden comment: C1005JB1V105K050BC)
C89  value 1µF  Case/Package: 0402  Voltage Rating: 35V  [FP-C1005-050-0_05-IPC_A]  (hidden comment: C1005JB1V105K050BC)
C90  value 1µF  Case/Package: 0402  Voltage Rating: 35V  [FP-C1005-050-0_05-IPC_A]  (hidden comment: C1005JB1V105K050BC)
C91  value 100nF  Voltage Rating: 25V  Case/Package: 0402  [FP-CL830-IPC_A]  (hidden comment: CL05B104KA5NNNC)
C92  value 100nF  Voltage Rating: 25V  Case/Package: 0402  [FP-CL830-IPC_A]  (hidden comment: CL05B104KA5NNNC)
C93  value 100nF  Voltage Rating: 25V  Case/Package: 0402  [FP-CL830-IPC_A]  (hidden comment: CL05B104KA5NNNC)
C94  value 100nF  Voltage Rating: 25V  Case/Package: 0402  [FP-CL830-IPC_A]  (hidden comment: CL05B104KA5NNNC)
C95  value 100nF  Voltage Rating: 25V  Case/Package: 0402  [FP-CL830-IPC_A]  (hidden comment: CL05B104KA5NNNC)
C96  value 100nF  Voltage Rating: 25V  Case/Package: 0402  [FP-CL830-IPC_A]  (hidden comment: CL05B104KA5NNNC)
C97  value 1µF  Case/Package: 0402  Voltage Rating: 35V  [FP-C1005-050-0_05-IPC_A]  (hidden comment: C1005JB1V105K050BC)
C98  value 1µF  Case/Package: 0402  Voltage Rating: 35V  [FP-C1005-050-0_05-IPC_A]  (hidden comment: C1005JB1V105K050BC)
C99  value 1µF  Case/Package: 0402  Voltage Rating: 35V  [FP-C1005-050-0_05-IPC_A]  (hidden comment: C1005JB1V105K050BC)
D8  599-0480-127F  [QTLP650D4TR-Footprint-1]  (value not drawn)
D9  599-0480-127F  [QTLP650D4TR-Footprint-1]  (value not drawn)
D10  599-0480-127F  [QTLP650D4TR-Footprint-1]  (value not drawn)
D11  599-0480-127F  [QTLP650D4TR-Footprint-1]  (value not drawn)
D12  599-0480-127F  [QTLP650D4TR-Footprint-1]  (value not drawn)
D13  599-0480-127F  [QTLP650D4TR-Footprint-1]  (value not drawn)
D14  599-0480-127F  [QTLP650D4TR-Footprint-1]  (value not drawn)
D15  599-0480-127F  [QTLP650D4TR-Footprint-1]  (value not drawn)
D16  599-0480-127F  [QTLP650D4TR-Footprint-1]  (value not drawn)
F1  01220088ZR  [New footprint 1]  (value not drawn)
F2  01220088ZR  [New footprint 1]  (value not drawn)
F3  01220088ZR  [New footprint 1]  (value not drawn)
F4  01220088ZR  [New footprint 1]  (value not drawn)
F5  01220088ZR  [New footprint 1]  (value not drawn)
F6  01220088ZR  [New footprint 1]  (value not drawn)
F7  01220088ZR  [New footprint 1]  (value not drawn)
F8  01220088ZR  [New footprint 1]  (value not drawn)
F9  01220088ZR  [New footprint 1]  (value not drawn)
J3  796949-8  [796949-8-Footprint-1]
J4  796949-8  [796949-8-Footprint-1]
Out1  1777561  [1777561-Footprint-1]
Out2  1777561  [1777561-Footprint-1]
Out3  1777561  [1777561-Footprint-1]
P2  61300621121  [61300621121]
P3  61300621121  [61300621121]
P4  61300621121  [61300621121]
R92  value 7.5M  Case/Package: 1206  Power: 250mW  [FP-KTR18-IPC_A]  (hidden comment: KTR18EZPF7504)
R93  value 7.5M  Case/Package: 1206  Power: 250mW  [FP-KTR18-IPC_A]  (hidden comment: KTR18EZPF7504)
R94  value 7.5M  Case/Package: 1206  Power: 250mW  [FP-KTR18-IPC_A]  (hidden comment: KTR18EZPF7504)
R95  value 7.5M  Case/Package: 1206  Power: 250mW  [FP-KTR18-IPC_A]  (hidden comment: KTR18EZPF7504)
R96  value 7.5M  Case/Package: 1206  Power: 250mW  [FP-KTR18-IPC_A]  (hidden comment: KTR18EZPF7504)
R97  value 7.5M  Case/Package: 1206  Power: 250mW  [FP-KTR18-IPC_A]  (hidden comment: KTR18EZPF7504)
R98  value 7.5M  Case/Package: 1206  Power: 250mW  [FP-KTR18-IPC_A]  (hidden comment: KTR18EZPF7504)
R99  value 7.5M  Case/Package: 1206  Power: 250mW  [FP-KTR18-IPC_A]  (hidden comment: KTR18EZPF7504)
R100  value 7.5M  Case/Package: 1206  Power: 250mW  [FP-KTR18-IPC_A]  (hidden comment: KTR18EZPF7504)
R101  value 100k  Case/Package: 1206  Power: 250mW  [RESC3216X70X40NL20T20]  (hidden comment: RK73H2BTTD1003F)
R102  value 100k  Case/Package: 1206  Power: 250mW  [RESC3216X70X40NL20T20]  (hidden comment: RK73H2BTTD1003F)
R103  value 100k  Case/Package: 1206  Power: 250mW  [RESC3216X70X40NL20T20]  (hidden comment: RK73H2BTTD1003F)
R104  value 7.5M  Case/Package: 1206  Power: 250mW  [FP-KTR18-IPC_A]  (hidden comment: KTR18EZPF7504)
R105  value 7.5M  Case/Package: 1206  Power: 250mW  [FP-KTR18-IPC_A]  (hidden comment: KTR18EZPF7504)
R106  value 7.5M  Case/Package: 1206  Power: 250mW  [FP-KTR18-IPC_A]  (hidden comment: KTR18EZPF7504)
R107  value 10kR  Package: 0402  Power: 0.1W  [RESC1005X40X25LL10T10]  (hidden comment: RK73H1ETTP1002F)
R108  value 1kR  Package: 0402  Power: 0.1W  [RESC1005X40X25LL10T10]  (hidden comment: RK73H1ETTP1001F)
R109  value 10kR  Package: 0402  Power: 0.1W  [RESC1005X40X25LL10T10]  (hidden comment: RK73H1ETTP1002F)
R110  value 1kR  Package: 0402  Power: 0.1W  [RESC1005X40X25LL10T10]  (hidden comment: RK73H1ETTP1001F)
R111  value 10kR  Package: 0402  Power: 0.1W  [RESC1005X40X25LL10T10]  (hidden comment: RK73H1ETTP1002F)
R112  value 1kR  Package: 0402  Power: 0.1W  [RESC1005X40X25LL10T10]  (hidden comment: RK73H1ETTP1001F)
R113  value 100k  Case/Package: 1206  Power: 250mW  [RESC3216X70X40NL20T20]  (hidden comment: RK73H2BTTD1003F)
R114  value 100k  Case/Package: 1206  Power: 250mW  [RESC3216X70X40NL20T20]  (hidden comment: RK73H2BTTD1003F)
R115  value 100k  Case/Package: 1206  Power: 250mW  [RESC3216X70X40NL20T20]  (hidden comment: RK73H2BTTD1003F)
R116  value 7.5M  Case/Package: 1206  Power: 250mW  [FP-KTR18-IPC_A]  (hidden comment: KTR18EZPF7504)
R117  value 7.5M  Case/Package: 1206  Power: 250mW  [FP-KTR18-IPC_A]  (hidden comment: KTR18EZPF7504)
R118  value 7.5M  Case/Package: 1206  Power: 250mW  [FP-KTR18-IPC_A]  (hidden comment: KTR18EZPF7504)
R119  value 7.5M  Case/Package: 1206  Power: 250mW  [FP-KTR18-IPC_A]  (hidden comment: KTR18EZPF7504)
R120  value 7.5M  Case/Package: 1206  Power: 250mW  [FP-KTR18-IPC_A]  (hidden comment: KTR18EZPF7504)
R121  value 7.5M  Case/Package: 1206  Power: 250mW  [FP-KTR18-IPC_A]  (hidden comment: KTR18EZPF7504)
R122  value 7.5M  Case/Package: 1206  Power: 250mW  [FP-KTR18-IPC_A]  (hidden comment: KTR18EZPF7504)
R123  value 7.5M  Case/Package: 1206  Power: 250mW  [FP-KTR18-IPC_A]  (hidden comment: KTR18EZPF7504)
R124  value 7.5M  Case/Package: 1206  Power: 250mW  [FP-KTR18-IPC_A]  (hidden comment: KTR18EZPF7504)
R125  value 100k  Case/Package: 1206  Power: 250mW  [RESC3216X70X40NL20T20]  (hidden comment: RK73H2BTTD1003F)
R126  value 100k  Case/Package: 1206  Power: 250mW  [RESC3216X70X40NL20T20]  (hidden comment: RK73H2BTTD1003F)
R127  value 100k  Case/Package: 1206  Power: 250mW  [RESC3216X70X40NL20T20]  (hidden comment: RK73H2BTTD1003F)
R128  value 7.5M  Case/Package: 1206  Power: 250mW  [FP-KTR18-IPC_A]  (hidden comment: KTR18EZPF7504)
R129  value 7.5M  Case/Package: 1206  Power: 250mW  [FP-KTR18-IPC_A]  (hidden comment: KTR18EZPF7504)
R130  value 7.5M  Case/Package: 1206  Power: 250mW  [FP-KTR18-IPC_A]  (hidden comment: KTR18EZPF7504)
R131  value 10kR  Package: 0402  Power: 0.1W  [RESC1005X40X25LL10T10]  (hidden comment: RK73H1ETTP1002F)
R132  value 1kR  Package: 0402  Power: 0.1W  [RESC1005X40X25LL10T10]  (hidden comment: RK73H1ETTP1001F)
R133  value 10kR  Package: 0402  Power: 0.1W  [RESC1005X40X25LL10T10]  (hidden comment: RK73H1ETTP1002F)
R134  value 1kR  Package: 0402  Power: 0.1W  [RESC1005X40X25LL10T10]  (hidden comment: RK73H1ETTP1001F)
R135  value 10kR  Package: 0402  Power: 0.1W  [RESC1005X40X25LL10T10]  (hidden comment: RK73H1ETTP1002F)
R136  value 1kR  Package: 0402  Power: 0.1W  [RESC1005X40X25LL10T10]  (hidden comment: RK73H1ETTP1001F)
R137  value 100k  Case/Package: 1206  Power: 250mW  [RESC3216X70X40NL20T20]  (hidden comment: RK73H2BTTD1003F)
R138  value 100k  Case/Package: 1206  Power: 250mW  [RESC3216X70X40NL20T20]  (hidden comment: RK73H2BTTD1003F)
R139  value 100k  Case/Package: 1206  Power: 250mW  [RESC3216X70X40NL20T20]  (hidden comment: RK73H2BTTD1003F)
R140  value 7.5M  Case/Package: 1206  Power: 250mW  [FP-KTR18-IPC_A]  (hidden comment: KTR18EZPF7504)
R141  value 7.5M  Case/Package: 1206  Power: 250mW  [FP-KTR18-IPC_A]  (hidden comment: KTR18EZPF7504)
R142  value 7.5M  Case/Package: 1206  Power: 250mW  [FP-KTR18-IPC_A]  (hidden comment: KTR18EZPF7504)
R143  value 7.5M  Case/Package: 1206  Power: 250mW  [FP-KTR18-IPC_A]  (hidden comment: KTR18EZPF7504)
R144  value 7.5M  Case/Package: 1206  Power: 250mW  [FP-KTR18-IPC_A]  (hidden comment: KTR18EZPF7504)
R145  value 7.5M  Case/Package: 1206  Power: 250mW  [FP-KTR18-IPC_A]  (hidden comment: KTR18EZPF7504)
R146  value 7.5M  Case/Package: 1206  Power: 250mW  [FP-KTR18-IPC_A]  (hidden comment: KTR18EZPF7504)
R147  value 7.5M  Case/Package: 1206  Power: 250mW  [FP-KTR18-IPC_A]  (hidden comment: KTR18EZPF7504)
R148  value 7.5M  Case/Package: 1206  Power: 250mW  [FP-KTR18-IPC_A]  (hidden comment: KTR18EZPF7504)
R149  value 100k  Case/Package: 1206  Power: 250mW  [RESC3216X70X40NL20T20]  (hidden comment: RK73H2BTTD1003F)
R150  value 100k  Case/Package: 1206  Power: 250mW  [RESC3216X70X40NL20T20]  (hidden comment: RK73H2BTTD1003F)
R151  value 100k  Case/Package: 1206  Power: 250mW  [RESC3216X70X40NL20T20]  (hidden comment: RK73H2BTTD1003F)
R152  value 7.5M  Case/Package: 1206  Power: 250mW  [FP-KTR18-IPC_A]  (hidden comment: KTR18EZPF7504)
R153  value 7.5M  Case/Package: 1206  Power: 250mW  [FP-KTR18-IPC_A]  (hidden comment: KTR18EZPF7504)
R154  value 7.5M  Case/Package: 1206  Power: 250mW  [FP-KTR18-IPC_A]  (hidden comment: KTR18EZPF7504)
R155  value 10kR  Package: 0402  Power: 0.1W  [RESC1005X40X25LL10T10]  (hidden comment: RK73H1ETTP1002F)
R156  value 1kR  Package: 0402  Power: 0.1W  [RESC1005X40X25LL10T10]  (hidden comment: RK73H1ETTP1001F)
R157  value 10kR  Package: 0402  Power: 0.1W  [RESC1005X40X25LL10T10]  (hidden comment: RK73H1ETTP1002F)
R158  value 1kR  Package: 0402  Power: 0.1W  [RESC1005X40X25LL10T10]  (hidden comment: RK73H1ETTP1001F)
R159  value 10kR  Package: 0402  Power: 0.1W  [RESC1005X40X25LL10T10]  (hidden comment: RK73H1ETTP1002F)
R160  value 1kR  Package: 0402  Power: 0.1W  [RESC1005X40X25LL10T10]  (hidden comment: RK73H1ETTP1001F)
R161  value 100k  Case/Package: 1206  Power: 250mW  [RESC3216X70X40NL20T20]  (hidden comment: RK73H2BTTD1003F)
R162  value 100k  Case/Package: 1206  Power: 250mW  [RESC3216X70X40NL20T20]  (hidden comment: RK73H2BTTD1003F)
R163  value 100k  Case/Package: 1206  Power: 250mW  [RESC3216X70X40NL20T20]  (hidden comment: RK73H2BTTD1003F)
U21  SN74LVC1G14DCKR  [DCK0005A_N]  (value not drawn)  (parts A,B of 2)
U22  SN74LVC1G14DCKR  [DCK0005A_N]  (value not drawn)  (parts A,B of 2)
U23  SN74LVC1G14DCKR  [DCK0005A_N]  (value not drawn)  (parts A,B of 2)
U24  TLV6001UIDBVR  [TLV6001UIDBVR-Footprint-1]  (value not drawn)
U25  TLV6001UIDBVR  [TLV6001UIDBVR-Footprint-1]  (value not drawn)
U26  TLV6001UIDBVR  [TLV6001UIDBVR-Footprint-1]  (value not drawn)
U27  SN74LVC1G14DCKR  [DCK0005A_N]  (value not drawn)  (parts A,B of 2)
U28  SN74LVC1G14DCKR  [DCK0005A_N]  (value not drawn)  (parts A,B of 2)
U29  SN74LVC1G14DCKR  [DCK0005A_N]  (value not drawn)  (parts A,B of 2)
U30  TLV6001UIDBVR  [TLV6001UIDBVR-Footprint-1]  (value not drawn)
U31  TLV6001UIDBVR  [TLV6001UIDBVR-Footprint-1]  (value not drawn)
U32  TLV6001UIDBVR  [TLV6001UIDBVR-Footprint-1]  (value not drawn)
U33  SN74LVC1G14DCKR  [DCK0005A_N]  (parts A,B of 2)
U34  SN74LVC1G14DCKR  [DCK0005A_N]  (parts A,B of 2)
U35  SN74LVC1G14DCKR  [DCK0005A_N]  (parts A,B of 2)
U36  TLV6001UIDBVR  [TLV6001UIDBVR-Footprint-1]  (value not drawn)
U37  TLV6001UIDBVR  [TLV6001UIDBVR-Footprint-1]  (value not drawn)
U38  TLV6001UIDBVR  [TLV6001UIDBVR-Footprint-1]  (value not drawn)
VR  PC16SV-10IP06-103A2020-TA  [PC16SV-10IP06-103A2020-TA-Footprint-1]  (value not drawn)

### Blocks framed on the sheet
Fuse Blow Indicator: C73-C99 D8-D16 R92-R163 U21-U38
Interface To the Fans: F1-F9 J3 J4 Out1-Out3 P2-P4

### Ports
5V (in), 10V (in), A (in), B (in), C (in), DP_Fan (in), GND (bidir), PWM_FAN (in), RSA_Fan1 (bidir), RSA_Fan2 (bidir), RSA_Fan3 (bidir), RSB_Fan1 (bidir), RSB_Fan2 (bidir), RSB_Fan3 (bidir)

### Nets
5V: C73.1 C74.1 C75.1 C76.2 C77.2 C78.2 C82.1 C83.1 C84.1 C85.2 C86.2 C87.2 C91.2 C92.1 C93.2 C94.1 C95.2 C96.1 U21.5(VCC) U22.5(VCC) U23.5(VCC) U24.5(V+) U25.5(V+) U26.5(V+) U27.5(VCC) U28.5(VCC) U29.5(VCC) U30.5(V+) U31.5(V+) U32.5(V+) U33.5(VCC) U34.5(VCC) U35.5(VCC) U36.5(V+) U37.5(V+) U38.5(V+) ; port 5V
10V: VR.1 ; port 10V
GND: C73.2 C74.2 C75.2 C76.1 C77.1 C78.1 C79.2 C80.2 C81.2 C82.2 C83.2 C84.2 C85.1 C86.1 C87.1 C88.2 C89.2 C90.2 C91.1 C92.2 C93.1 C94.2 C95.1 C96.2 C97.2 C98.2 C99.2 J3.5 J4.3 J4.8 R101.1 R102.1 R103.1 R108.2 R110.2 R112.2 R113.1 R114.1 R115.1 R125.1 R126.1 R127.1 R132.2 R134.2 R136.2 R137.1 R138.1 R139.1 R149.1 R150.1 R151.1 R156.2 R158.2 R160.2 R161.1 R162.1 R163.1 U21.3(GND) U22.3(GND) U23.3(GND) U24.2(V-) U25.2(V-) U26.2(V-) U27.3(GND) U28.3(GND) U29.3(GND) U30.2(V-) U31.2(V-) U32.2(V-) U33.3(GND) U34.3(GND) U35.3(GND) U36.2(V-) U37.2(V-) U38.2(V-) VR.3 ; port GND
PE: Out1.1 Out2.1 Out3.1
A: F1.1 F4.1 F7.1 R98.2 R99.2 R100.2 ; port A  [also labelled F1_P, F4_P, F7_P]
B: F2.1 F5.1 F8.1 R122.2 R123.2 R124.2 ; port B  [also labelled F2_P, F5_P, F8_P]
C: F3.1 F6.1 F9.1 R146.2 R147.2 R148.2 ; port C  [also labelled F3_P, F6_P, F9_P]
DP_Fan: P2.5 P3.5 P4.5 ; port DP_Fan
F1_S: F1.2 Out1.4 R92.2
F2_S: F2.2 Out1.3 R116.2
F3_S: F3.2 Out1.2 R140.2
F4_S: F4.2 Out2.4 R93.2
F5_S: F5.2 Out2.3 R117.2
F6_S: F6.2 Out2.2 R141.2
F7_S: F7.2 Out3.4 R94.2
F8_S: F8.2 Out3.3 R118.2
F9_S: F9.2 Out3.2 R142.2
Fan1_out: J3.4 P2.3 P2.4
Fan2_out: J4.7 P3.3 P3.4
Fan3_out: J4.2 P4.3 P4.4
POT: P2.2 P3.2 P4.2 VR.2
PWM_FAN: P2.1 P3.1 P4.1 ; port PWM_FAN
RSA_Fan1: J3.2 J3.7 J4.5 ; port RSA_Fan3, port RSA_Fan2, port RSA_Fan1
RSB_Fan1: J3.1 J3.6 J4.4 ; port RSB_Fan3, port RSB_Fan2, port RSB_Fan1
NetC79_1: C79.1 R107.1 U21.2(A)
NetC80_1: C80.1 R109.1 U22.2(A)
NetC81_1: C81.1 R111.1 U23.2(A)
NetC88_1: C88.1 R131.1 U27.2(A)
NetC89_1: C89.1 R133.1 U28.2(A)
NetC90_1: C90.1 R135.1 U29.2(A)
NetC97_1: C97.1 R155.1 U33.2(A)
NetC98_1: C98.1 R157.1 U34.2(A)
NetC99_1: C99.1 R159.1 U35.2(A)
NetD8_1: D8.1(A) U21.4(Y)
NetD8_2: D8.2(K) R108.1
NetD9_1: D9.1(A) U22.4(Y)
NetD9_2: D9.2(K) R110.1
NetD10_1: D10.1(A) U23.4(Y)
NetD10_2: D10.2(K) R112.1
NetD11_1: D11.1(A) U27.4(Y)
NetD11_2: D11.2(K) R132.1
NetD12_1: D12.1(A) U28.4(Y)
NetD12_2: D12.2(K) R134.1
NetD13_1: D13.1(A) U29.4(Y)
NetD13_2: D13.2(K) R136.1
NetD14_1: D14.1(A) U33.4(Y)
NetD14_2: D14.2(K) R156.1
NetD15_1: D15.1(A) U34.4(Y)
NetD15_2: D15.2(K) R158.1
NetD16_1: D16.1(A) U35.4(Y)
NetD16_2: D16.2(K) R160.1
NetR92_1: R92.1 R95.2
NetR93_1: R93.1 R96.2
NetR94_1: R94.1 R97.2
NetR95_1: R95.1 R101.2 U24.3(+IN)
NetR96_1: R96.1 R102.2 U25.3(+IN)
NetR97_1: R97.1 R103.2 U26.3(+IN)
NetR98_1: R98.1 R104.2
NetR99_1: R99.1 R105.2
NetR100_1: R100.1 R106.2
NetR104_1: R104.1 R113.2 U24.4(-IN)
NetR105_1: R105.1 R114.2 U25.4(-IN)
NetR106_1: R106.1 R115.2 U26.4(-IN)
NetR107_2: R107.2 U24.1(OUT)
NetR109_2: R109.2 U25.1(OUT)
NetR111_2: R111.2 U26.1(OUT)
NetR116_1: R116.1 R119.2
NetR117_1: R117.1 R120.2
NetR118_1: R118.1 R121.2
NetR119_1: R119.1 R125.2 U30.3(+IN)
NetR120_1: R120.1 R126.2 U31.3(+IN)
NetR121_1: R121.1 R127.2 U32.3(+IN)
NetR122_1: R122.1 R128.2
NetR123_1: R123.1 R129.2
NetR124_1: R124.1 R130.2
NetR128_1: R128.1 R137.2 U30.4(-IN)
NetR129_1: R129.1 R138.2 U31.4(-IN)
NetR130_1: R130.1 R139.2 U32.4(-IN)
NetR131_2: R131.2 U30.1(OUT)
NetR133_2: R133.2 U31.1(OUT)
NetR135_2: R135.2 U32.1(OUT)
NetR140_1: R140.1 R143.2
NetR141_1: R141.1 R144.2
NetR142_1: R142.1 R145.2
NetR143_1: R143.1 R149.2 U36.3(+IN)
NetR144_1: R144.1 R150.2 U37.3(+IN)
NetR145_1: R145.1 R151.2 U38.3(+IN)
NetR146_1: R146.1 R152.2
NetR147_1: R147.1 R153.2
NetR148_1: R148.1 R154.2
NetR152_1: R152.1 R161.2 U36.4(-IN)
NetR153_1: R153.1 R162.2 U37.4(-IN)
NetR154_1: R154.1 R163.2 U38.4(-IN)
NetR155_2: R155.2 U36.1(OUT)
NetR157_2: R157.2 U37.1(OUT)
NetR159_2: R159.2 U38.1(OUT)

Not connected (* = marked no-connect by the designer): J3 3* 8*; J4 1* 6*; P2 6*; P3 6*; P4 6*; U21 1(NC)*; U22 1(NC)*; U23 1(NC)*; U27 1(NC)*; U28 1(NC)*; U29 1(NC)*; U33 1(NC)*; U34 1(NC)*; U35 1(NC)*

### Layout directives
net class Control Signals: DP_Fan, Fan1_out, Fan2_out, Fan3_out, GND, POT, PWM_FAN
net class HV: A, B, C, F1_P, F1_S, F2_P, F2_S, F3_P, F3_S, F4_P, F4_S, F5_P, F5_S, F6_P, F6_S, F7_P, F7_S, F8_P, F8_S, F9_P, F9_S, PE
net class HV2: F1_P, F1_S, F2_P, F2_S, F3_P, F3_S, F4_P, F4_S, F5_P, F5_S, F6_P, F6_S, F7_P, F7_S, F8_P, F8_S, F9_P, F9_S

### Notes on the sheet
- Title:
- Date:
- Drawn By:
- File:
- Time:
- Checked By:
- Sheet
- of
- (in symbol CMP-014-00008-4) IN+; IN-

### Library data of the parts
C73-C78 C82-C87 C91-C96 = CMP-001-00333-1: as C32 on sheet VoltageSensing; Max Operating Temperature: 125°C; RoHS Compliant: Yes; Capacitor Type: Ceramic; Min Operating Temperature: -55°C; Pins: 2; Mounting Technology: Surface Mount
C79-C81 C88-C90 C97-C99 = CMP-001-00329-1: Ceramic Capacitor, Multilayer, Ceramic, 35V, 10% +Tol, 10% -Tol, JB, 10% TC, 1uF, Surface Mount, 0402; Capacitor Type: Ceramic; Min Operating Temperature: -25°C; RoHS Compliant: Yes; Max Operating Temperature: 85°C; Pins: 2; Mounting Technology: Surface Mount
D8-D16 = CMP-007-00044-2: Single Color LEDs 1206 w/LENS TRUE GREEN 525nm; Value: Green, 2.1V 1206 (3216 Metric)
F1-F9 = CMP-002-00085-5: 250VAC 30A 10KA
J3 J4 = CMP-002-01212-1: Fixed Terminal Blocks 8 POS TERMI-BLOK PCB MOUNT; Voltage Rating: 250V; Mounting Technology: Cable; RoHS Compliant: Yes
Out1-Out3 = CMP-002-01216-2: as In on sheet Main.BoardSchDoc; Mounting Technology: Board; RoHS Compliant: Yes
P2-P4 = CMP-002-00286-1: WR-PHD Pin Header, THT, Vertical, pitch 2.54mm, 2 Row, 6P; Manufacturer: Wurth Elektronik; Contact Resistance: 20mOhm; Rated Current: 3A; Withstanding Voltage: 500V; Working Voltage: 250V; ComponentLink1Description: Website Link; Category: Board-to-Board Connectors; Operating Temperature Min: -40°C; Pin Count: 6; Orientation: Vertical; Pins: 6; Source: WR-PHD.SchLib; Component Type: Standard; ComponentLink2Description: Datasheet Link; Match Code: WR-PHD; Design Item ID: 61300621121; Manufacturer Part Number: 61300621121; ComponentLink2URL: https://www.we-online.com/redexpert/spec/61300621121?ad; Operating Temperature Max: 105°C; Pitch: 2.54mm; Gender: Pin Header; ComponentLink1URL: https://www.we-online.com/redexpert/article/61300621121?ad; Packaging: Bag; Mount: Through Hole; Number of Rows: 2
R92-R100 R104-R106 R116-R124 R128-R130 R140-R148 R152-R154 = CMP-009-01037-1: as R38 on sheet VoltageSensing; Voltage Rating: 500V; Min Operating Temperature: -55°C; Max Operating Temperature: 155°C; RoHS Compliant: Yes; Pins: 2; Mounting Technology: Surface Mount; Tolerance: 1%
R101-R103 R113-R115 R125-R127 R137-R139 R149-R151 R161-R163 = CMP-009-00972-1: Fixed Resistor, Metal Glaze/thick Film, 0.25W, 100000ohm, 200V, 1% +/-Tol, 100ppm/Cel, Surface Mount, 1206; Tolerance: 1%; Max Operating Temperature: 155°C; Pins: 2; Min Operating Temperature: -55°C; RoHS Compliant: Yes; Mounting Technology: Surface Mount
R107 R109 R111 R131 R133 R135 R155 R157 R159 = CMP-x00150-2: as R41 on sheet VoltageSensing
R108 R110 R112 R132 R134 R136 R156 R158 R160 = CMP-x00163-2: Fixed Resistor, Metal Glaze/thick Film, 0.1W, 1000ohm, 75V, 1% +/-Tol, 100ppm/Cel, Surface Mount, 0402; Manufacturer: KOA Speer; Template: KS_0402_R; Category: Resistors
U21-U23 U27-U29 U33-U35 = CMP-00114-2: Inverter, LVC/LCX/Z Series, 1-Func, 1-Input, CMOS, PDSO5
U24-U26 U30-U32 U36-U38 = CMP-014-00008-4: Operational Amplifiers - Op Amps 1-Channel, 1-MHz, low power op amp for cost-sensitive systems 5-SOT-23 -40 to 125; Template: TI_SOT_23_5
VR = CMP-009-01039-2: 10k Ohm 1 Gang Linear Panel Mount Potentiometer 1.0 Turns Carbon 0.2W, 1/5W PC Pins